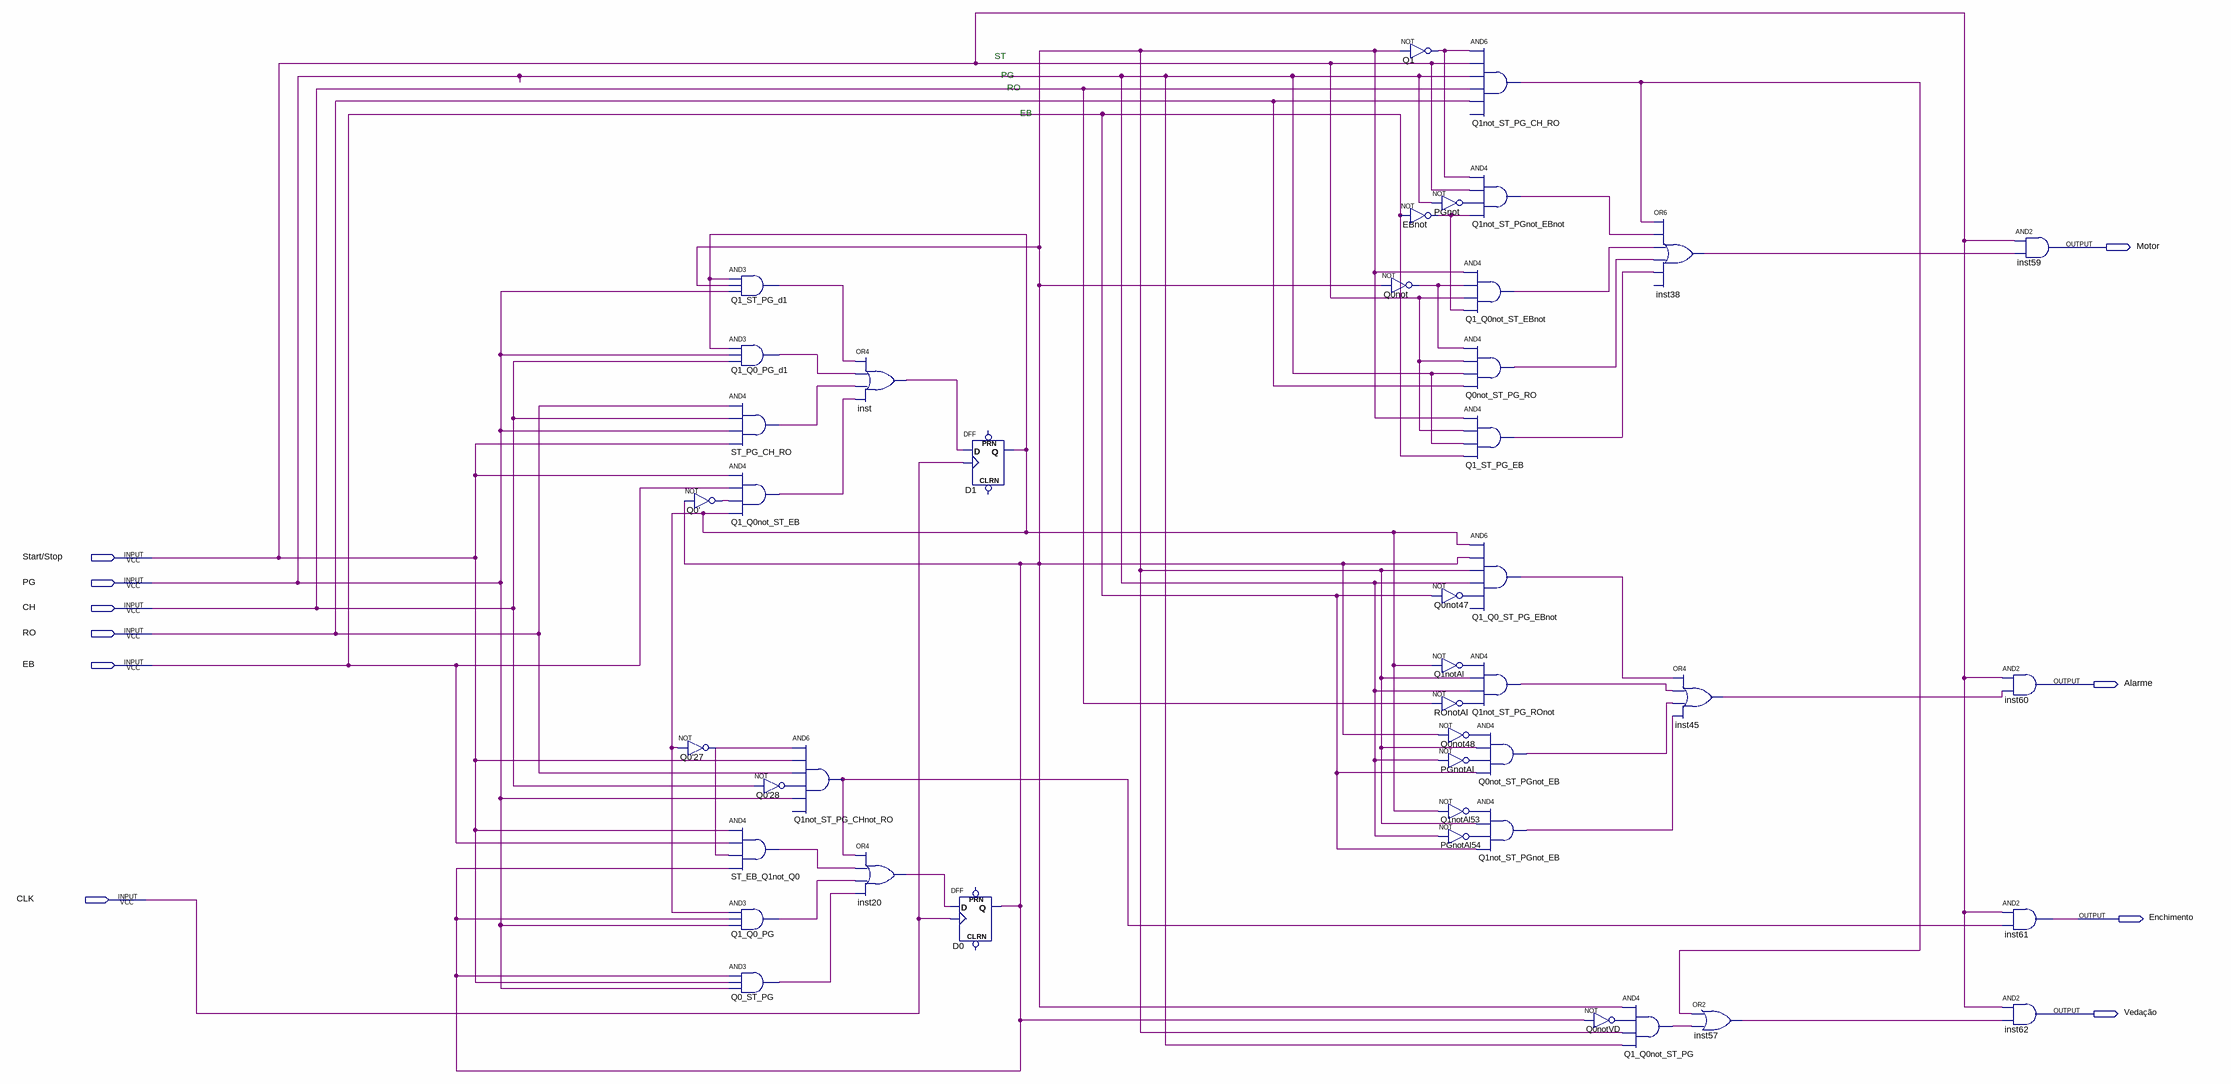
[diagram p0: schematic sheet]
// Quartus schematic problema3_industria_sopragarantir.bdf as structural Verilog: 44 symbols, 10 pins
module problema3_industria_sopragarantir (
  input  \Start/Stop ,
  input  PG,
  input  CH,
  input  RO,
  input  EB,
  input  CLK,
  output Motor,
  output Alarme,
  output Enchimento,
  output \Vedação 
);

  wire D0_q, D1_q, EBnot_out, inst20_out, inst38_out, inst45_out, inst57_out, inst_out, PGnot_out,
       PGnotAl54_out, PGnotAl_out, Q0_27_out, Q0_28_out, Q0__out, Q0_ST_PG_out, Q0not47_out, Q0not48_out,
       Q0not_out, Q0not_ST_PG_RO_out, Q0not_ST_PGnot_EB_out, Q0notVD_out, Q1_out, Q1_Q0_PG_d1_out,
       Q1_Q0_PG_out, Q1_Q0_ST_PG_EBnot_out, Q1_Q0not_ST_EB_out, Q1_Q0not_ST_EBnot_out, Q1_Q0not_ST_PG_out,
       Q1_ST_PG_d1_out, Q1_ST_PG_EB_out, Q1not_ST_PG_CH_RO_out, Q1not_ST_PG_CHnot_RO_out,
       Q1not_ST_PG_ROnot_out, Q1not_ST_PGnot_EB_out, Q1not_ST_PGnot_EBnot_out, Q1notAl53_out, Q1notAl_out,
       ROnotAl_out, ST_EB_Q1not_Q0_out, ST_PG_CH_RO_out;

  not \Q0'  (Q0__out, D0_q);
  not \Q0'27  (Q0_27_out, D1_q);
  and Q1_ST_PG_d1 (Q1_ST_PG_d1_out, D1_q, D0_q, PG);
  and Q1_Q0_PG_d1 (Q1_Q0_PG_d1_out, D1_q, PG, CH);
  and ST_PG_CH_RO (ST_PG_CH_RO_out, RO, CH, PG, \Start/Stop );
  and Q1_Q0not_ST_EB (Q1_Q0not_ST_EB_out, \Start/Stop , EB, Q0__out, D1_q);
  not \Q0'28  (Q0_28_out, CH);
  and ST_EB_Q1not_Q0 (ST_EB_Q1not_Q0_out, \Start/Stop , EB, Q0_27_out, D0_q);
  and Q1_Q0_PG (Q1_Q0_PG_out, D1_q, D0_q, PG);
  and Q0_ST_PG (Q0_ST_PG_out, D0_q, \Start/Stop , PG);
  and Q1not_ST_PG_CHnot_RO (Q1not_ST_PG_CHnot_RO_out, Q0_27_out, \Start/Stop , RO, Q0_28_out, PG);  // open: IN6
  or inst (inst_out, Q1_ST_PG_d1_out, Q1_Q0_PG_d1_out, ST_PG_CH_RO_out, Q1_Q0not_ST_EB_out);
  or inst20 (inst20_out, Q1not_ST_PG_CHnot_RO_out, ST_EB_Q1not_Q0_out, Q1_Q0_PG_out, Q0_ST_PG_out);
  DFF D1 (.CLK(CLK), .D(inst_out), .Q(D1_q));  // open: CLRN, PRN
  DFF D0 (.CLK(CLK), .D(inst20_out), .Q(D0_q));  // open: CLRN, PRN
  not Q1 (Q1_out, D0_q);
  not EBnot (EBnot_out, EB);
  not Q0not (Q0not_out, D0_q);
  and Q1not_ST_PG_CH_RO (Q1not_ST_PG_CH_RO_out, Q1_out, \Start/Stop , PG, CH, RO);  // open: IN6
  and Q1not_ST_PGnot_EBnot (Q1not_ST_PGnot_EBnot_out, Q1_out, \Start/Stop , PGnot_out, EBnot_out);
  not PGnot (PGnot_out, PG);
  and Q1_Q0not_ST_EBnot (Q1_Q0not_ST_EBnot_out, D0_q, Q0not_out, \Start/Stop , EBnot_out);
  and Q0not_ST_PG_RO (Q0not_ST_PG_RO_out, Q0not_out, \Start/Stop , PG, RO);
  and Q1_ST_PG_EB (Q1_ST_PG_EB_out, D0_q, \Start/Stop , PG, EB);
  and Q1_Q0_ST_PG_EBnot (Q1_Q0_ST_PG_EBnot_out, D1_q, D0_q, D0_q, PG, Q0not47_out);  // open: IN6
  not Q0not47 (Q0not47_out, EB);
  and Q1not_ST_PG_ROnot (Q1not_ST_PG_ROnot_out, Q1notAl_out, D0_q, PG, ROnotAl_out);
  not Q1notAl (Q1notAl_out, D1_q);
  not ROnotAl (ROnotAl_out, CH);
  not Q0not48 (Q0not48_out, D0_q);
  not PGnotAl (PGnotAl_out, PG);
  not Q1notAl53 (Q1notAl53_out, D1_q);
  not PGnotAl54 (PGnotAl54_out, PG);
  and Q0not_ST_PGnot_EB (Q0not_ST_PGnot_EB_out, Q0not48_out, D0_q, PGnotAl_out, EB);
  and Q1not_ST_PGnot_EB (Q1not_ST_PGnot_EB_out, Q1notAl53_out, D0_q, PGnotAl54_out, EB);
  and Q1_Q0not_ST_PG (Q1_Q0not_ST_PG_out, D0_q, Q0notVD_out, D0_q, PG);
  not Q0notVD (Q0notVD_out, D0_q);
  or inst38 (inst38_out, Q1not_ST_PG_CH_RO_out, Q1not_ST_PGnot_EBnot_out, Q1_Q0not_ST_EBnot_out, Q0not_ST_PG_RO_out, Q1_ST_PG_EB_out);  // open: IN6
  or inst45 (inst45_out, Q1_Q0_ST_PG_EBnot_out, Q1not_ST_PG_ROnot_out, Q0not_ST_PGnot_EB_out, Q1not_ST_PGnot_EB_out);
  or inst57 (inst57_out, Q1not_ST_PG_CH_RO_out, Q1_Q0not_ST_PG_out);
  and inst59 (Motor, \Start/Stop , inst38_out);
  and inst60 (Alarme, \Start/Stop , inst45_out);
  and inst61 (Enchimento, \Start/Stop , Q1not_ST_PG_CHnot_RO_out);
  and inst62 (\Vedação , \Start/Stop , inst57_out);

  // Notes on the sheet:
  //   ST
  //   PG
  //   RO
  //   EB
endmodule
